# EAGLE design working (EAGLE 9.6.2)
COMPANY: ADAFRUIT INDUSTRIES; DRAWN: KTOWN; REV: A
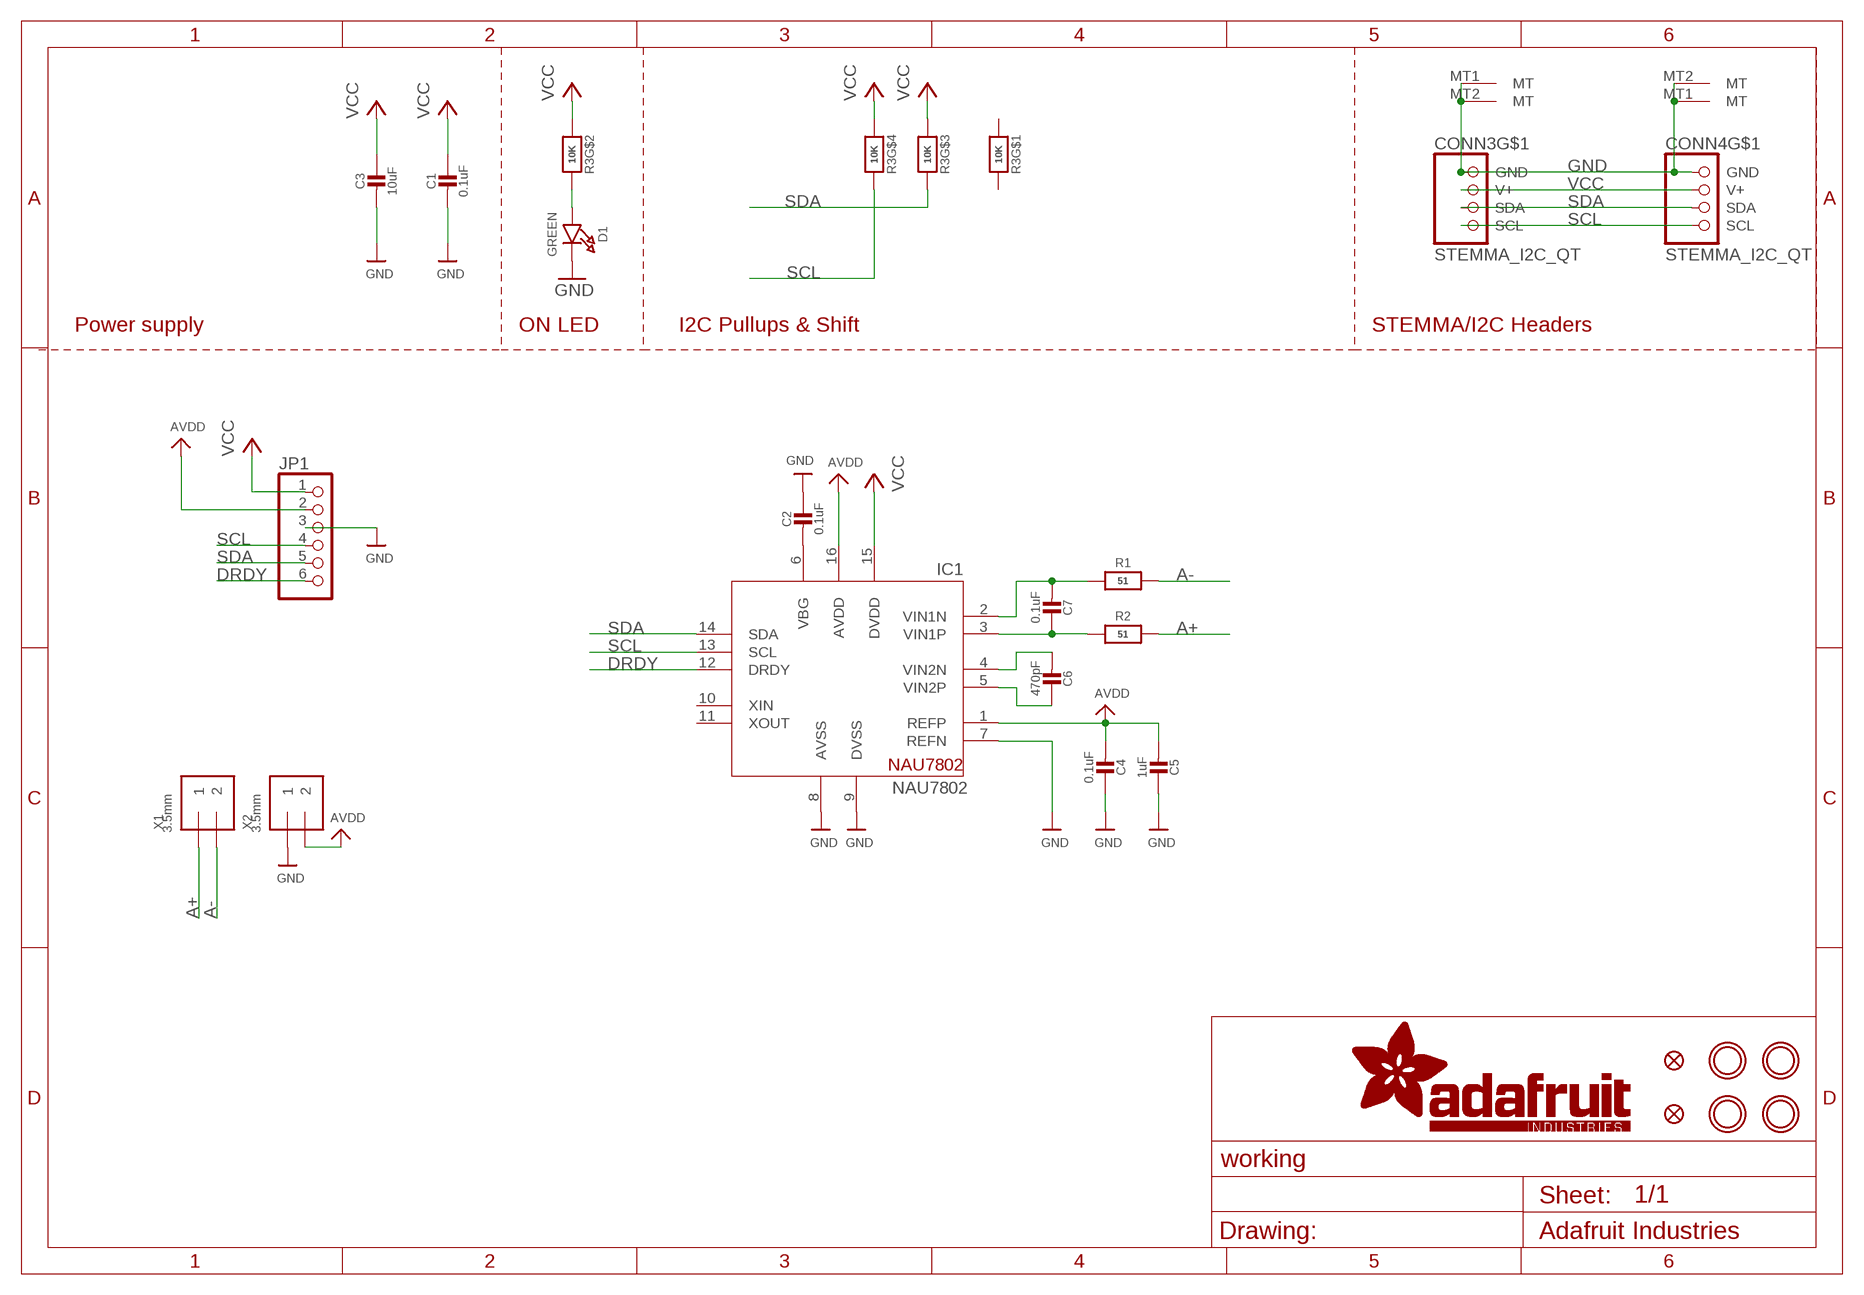
[diagram p0: schematic, sheet 1]

## Parts
C1  0.1uF  CAP_CERAMIC0603_NO  [0603-NO]
C2  0.1uF  CAP_CERAMIC0603_NO  [0603-NO]
C3  10uF  CAP_CERAMIC0805-NOOUTLINE  [0805-NO]
C4  0.1uF  CAP_CERAMIC0603_NO  [0603-NO]
C5  1uF  CAP_CERAMIC0603_NO  [0603-NO]
C6  470pF  CAP_CERAMIC0603_NO  [0603-NO]
C7  0.1uF  CAP_CERAMIC0603_NO  [0603-NO]
CONN3  STEMMA_I2C_QT  [JST_SH4]
CONN4  STEMMA_I2C_QT  [JST_SH4]
D1  GREEN  LED0603_NOOUTLINE  [CHIPLED_0603_NOOUTLINE]
FID3  FIDUCIAL_1MM  [FIDUCIAL_1MM]
FID4  FIDUCIAL_1MM  [FIDUCIAL_1MM]
IC1  NAU7802  [SOIC16_NARROW]
JP1  HEADER-1X670MIL  [1X06_ROUND_70]
R1  51  RESISTOR_0603_NOOUT  [0603-NO]
R2  51  RESISTOR_0603_NOOUT  [0603-NO]
R3  10K  RESISTOR_4PACK  [RESPACK_4X0603]
U$1  MOUNTINGHOLE2.5  [MOUNTINGHOLE_2.5_PLATED]
U$17  MOUNTINGHOLE2.5  [MOUNTINGHOLE_2.5_PLATED]
U$19  MOUNTINGHOLE2.5  [MOUNTINGHOLE_2.5_PLATED]
U$21  MOUNTINGHOLE2.5  [MOUNTINGHOLE_2.5_PLATED]
X1  3.5mm  TERMBLOCK_1X2_3.5MM  [TERMBLOCK_1X2-3.5MM]
X2  3.5mm  TERMBLOCK_1X2_3.5MM  [TERMBLOCK_1X2-3.5MM]

## Nets
A+: R2.2 X1.1
A-: R1.2 X1.2
AVDD: C4.2 C5.2 IC1.1(REFP) IC1.16(AVDD) JP1.2 X2.2
DRDY: IC1.12(DRDY) JP1.6
GND [highpower]: C1.2 C2.1 C3.2 C4.1 C5.1 CONN3.1(GND) CONN3.MT1(MT) CONN3.MT2(MT) CONN4.1(GND) CONN4.MT1(MT) CONN4.MT2(MT) D1.C IC1.7(REFN) IC1.8(AVSS) IC1.9(DVSS) JP1.3 X2.1
N$1: D1.A R3.7
N$2: C2.2 IC1.6(VBG)
N$3: C6.2 IC1.4(VIN2N)
N$4: C6.1 IC1.5(VIN2P)
N$5: C7.1 IC1.3(VIN1P) R2.1
N$6: C7.2 IC1.2(VIN1N) R1.1
SCL: CONN3.4(SCL) CONN4.4(SCL) IC1.13(SCL) JP1.4 R3.5
SDA: CONN3.3(SDA) CONN4.3(SDA) IC1.14(SDA) JP1.5 R3.6
VCC [highpower]: C1.1 C3.1 CONN3.2(V+) CONN4.2(V+) IC1.15(DVDD) JP1.1 R3.2 R3.3 R3.4
Unconnected: IC1.10(XIN) IC1.11(XOUT) R3.1 R3.8

## Notes on the sheet
- Power supply | ON LED | I2C Pullups & Shift | STEMMA/I2C Headers

## Library data of the parts
C1-C7 = microbuilder:CAP_CERAMIC: Ceramic Capacitors For new designs, use the packages preceded by an '_' character since they are more reliable: The following footprints should be used on most boards: _0402 - Standard footprint for regular board layouts _0603 - Standard footprint for regular board layouts _0805 - Standard footprint for regular board layouts _1206 - Standard footprint for regular board layouts For extremely tight-pitch boards where space is at a premium, the following 'micro-pitch' footprints can be used (smaller pads, no silkscreen outline, etc.): _0402MP - Micro-pitch footprint for very dense/compact boards _0603MP - Micro-pitch footprint for very dense/compact boards _0805MP - Micro-pitch footprint for very dense/compact boards _1206MP - Micro-pitch footprint for very dense/compact boards
CONN3 CONN4 = microbuilder:STEMMA_I2C
D1 = microbuilder:LED: LED 0603 - 0603 Surface Mount Package 2mA: Green LED - Low Power (3.9mcd, 2ma, 1.7Vf) - Digikey: 475-2709-2-ND Orange LED - Low Power (9.8mcd, 2ma, 1.8Vf) - Digikey: 475-1194-2-ND Red LED - Low Power (5mcd, 2ma, 1.8Vf) - Digikey: 475-1195-2-ND Yellow LED - Low Power (7mcd, 2ma, 1.8Vf) - Digikey: 475-1196-2-ND 5mA: Blue LED - Low Power (17mcd, 5ma, 2.9Vf) - Digikey: LNJ937W8CRACT-ND 0805 - 0805 Surface Mount Package 2mA: Red LED (8.8mcd, 2mA, 1.8Vf, Clear) - Low Power [Digikey: 475-2510-1-ND] Green LED (5mcd, 2mA, 1.8Vf, Clear) - Low Power [Digikey: 475-2730-1-ND] Yellow LED (11.3mcd, 2mA, 1.8Vf, Clear) - Low Power [Digikey: 475-2555-1-ND] 20mA: Red LED (104mcd, 20mA, Diffused) - LS R976 [Digikey: 475-1278-6-ND] Red LED (12mcd, 20mA, 2.0Vf, Clear) - APT2012EC [Digikey: 754-1128-1-ND] Green LED (15mcd, 20mA, 2.2Vf, Clear) - APT2012GC [Digikey: 754-1131-1-ND] Orange LED (160mcd, 20mA, 2.1Vf, Clear) - APT2012SECK [Digikey: 754-1130-1-ND] 1206 - 1206 Surface Mount Package Green LED (26mcd, 20mA, Diffused) - LG N971 [Digikey: 475-1407-6-ND] Red LED (15mcd, 20mA, Diffused) - LH N974 [Digikey: 475-1416-6-ND] Cree - Cree High-Power Surface Mount LEDs XPEBWT-L1-0000-00D50 - White 111lm 350mA 2.9Vf 6200K 110° XTEAWT-00-0000-00000LEE3 - White 114lm 350mA 2.85Vf 5000K 115° Everlight - Everlight 45-21 Series Surface Mount LEDs 45-21/QK2C-B2832AC2CB2/2T - Warm White 2000mcd 20mA 3.25Vf 3050K 120° 45-21/LK2C-B38452C4CB2/2T - Nuetral White 2000mcd 20mA 3.25Vf 4150K 120° 45-21/LK2C-B50634C6CB2/2T - Cold White 2200mcd 20mA 3.25Vf 5650K 120° PLCC2 Reverse Mount LS T77K-J1L2-1-0-2-R18-Z - Red 11.25mcd 2mA 1.8Vf 630nm 120° LO T77K-L1M2-24-Z - Orange 19.6mcd 2mA 1.8Vf 606nm 120° LY T77K-K2M1-26-Z - Yellow 15.7mcd 2mA 1.8Vf 587nm 120°
FID3 FID4 = microbuilder:FIDUCIAL: Fiducial Alignment Points Various fiducial points for machine vision alignment.; BOM: EXCLUDE
IC1 = adafruit_sensor:NAU7802
JP1 = microbuilder:HEADER-1X6: PIN HEADER
R1 R2 = microbuilder:RESISTOR: Resistors For new designs, use the packages preceded by an '_' character since they are more reliable: The following footprints should be used on most boards: _0402 - Standard footprint for regular board layouts _0603 - Standard footprint for regular board layouts _0805 - Standard footprint for regular board layouts _1206 - Standard footprint for regular board layouts For extremely tight-pitch boards where space is at a premium, the following 'micro-pitch' footprints can be used (smaller pads, no silkscreen outline, etc.): _0402MP - Micro-pitch footprint for very dense/compact boards _0603MP - Micro-pitch footprint for very dense/compact boards _0805MP - Micro-pitch footprint for very dense/compact boards _1206MP - Micro-pitch footprint for very dense/compact boards
R3 = microbuilder:RESISTOR_4PACK: Resistor Packs (4 resistors) 4 x 0603 10K 1/16W - Digikey: YC164J-10KCT-ND
U$1 U$17 U$19 U$21 = microbuilder:MOUNTINGHOLE: Mounting Hole For #2 screws (0.086"/2.18mm width, 0.094"/2.4mm hole) use 2.5mm; BOM: EXCLUDE
X1 X2 = microbuilder:TERMBLOCK_1X2: 3.5mm Terminal block http://www.ladyada.net/library/pcb/eaglelibrary.html

## Net classes
1 highpower: width 0.305 mm, drill 0.483 mm
2 lowpower: width 0.254 mm, drill 0.483 mm

## Board
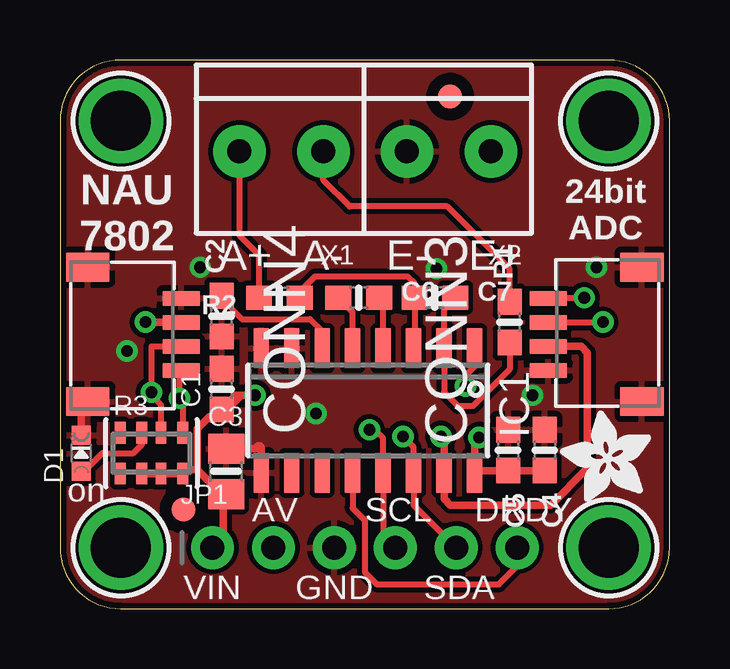
[diagram p1: board, top side]
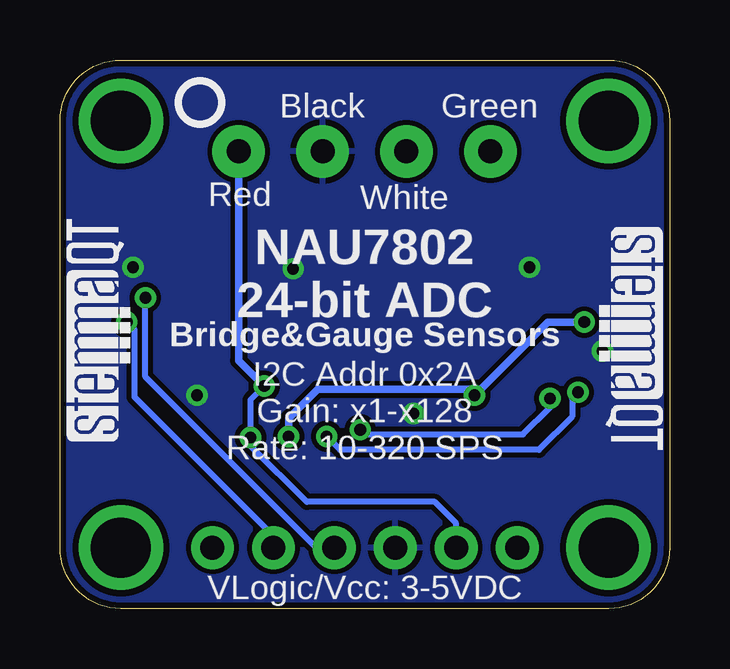
[diagram p2: board, bottom side, seen from below]

Size 25.4 x 22.86 mm. Coordinates in mm from the lower left corner, seen from the top.
Outline: 0,20.32 0,2.54 arc90 2.54,0 22.86,0 arc90 25.4,2.54 25.4,20.32 arc90 22.86,22.86 2.54,22.86 arc90 0,20.32
Copper layers (1*16): Top 0.035mm / dielectric 1.5mm / Bottom 0.035mm
Design rules "adafruit *": minimum track width 8mil, minimum drill 15.5mil, track to track 8mil, track to pad 8mil, pad to pad 8mil, via to via 8mil, smd to smd 8mil, copper to edge 10mil, drill to drill 8mil, minimum pad ring 10mil, minimum via ring 8mil, stop-mask expansion 2mil, vias tented up to drill 20mil, thermal gap 10mil

### Footprints (pad centres in the part's own frame; a part is rotated, then mirrored left to right if it is on the bottom)
0603-NO = smd 1.075 x 1: 1 -0.85,0; 2 0.85,0
0805-NO = smd 1.24 x 1.5: 1 -0.95,0; 2 0.95,0
JST_SH4 = smd 0.6 x 1.55: 1 -1.5,2.514; 2 -0.5,2.514; 3 0.5,2.514; 4 1.5,2.514 | smd 1.2 x 1.8: MT1 -2.8,-1.386; MT2 2.8,-1.386
CHIPLED_0603_NOOUTLINE = smd 0.8 x 0.8: A 0,-0.75; C 0,0.75
FIDUCIAL_1MM = smd 1 x 1: 1 0,0
SOIC16_NARROW = smd 0.635 x 1.651: 1 -4.445,-2.854; 2 -3.175,-2.854; 3 -1.905,-2.854; 4 -0.635,-2.854; 5 0.635,-2.854; 6 1.905,-2.854; 7 3.175,-2.854; 8 4.445,-2.854; 9 4.445,2.346; 10 3.175,2.346; 11 1.905,2.346; 12 0.635,2.346; 13 -0.635,2.346; 14 -1.905,2.346; 15 -3.175,2.346; 16 -4.445,2.346
1X06_ROUND_70 = drill 1 pad 1.778: 1 -6.35,0; 2 -3.81,0; 3 -1.27,0; 4 1.27,0; 5 3.81,0; 6 6.35,0
RESPACK_4X0603 = smd 0.45 x 0.9: 1 -1.3,-0.85; 2 -0.4,-0.85; 3 0.4,-0.85; 4 1.3,-0.85; 5 1.3,0.85; 6 0.4,0.85; 7 -0.4,0.85; 8 -1.3,0.85
MOUNTINGHOLE_2.5_PLATED = drill 2.5 pad 3.2: P$1 0,0
TERMBLOCK_1X2-3.5MM = drill 1 pad 2.184: 1 1.8,0; 2 -1.7,0

### Placement (x,y rotation side)
C1  6.73,9.14 90 top
C2  6.73,12.19 90 top
C3  6.92,5.71 90 top
C4  20.19,6.6 270 top
C5  18.67,6.6 270 top
C6  12.45,12.95 0 top
C7  15.62,12.95 0 top
CONN3  22.86,11.43 90 top
CONN4  2.54,11.43 270 top
D1  0.89,6.48 0 top
FID3  5.14,4.13 0 top
FID4  16.26,21.34 0 top
IC1  12.83,8 180 top
JP1  12.7,2.54 0 top
R1  18.73,11.94 90 top
R2  9.14,12.95 180 top
R3  3.81,6.48 0 top
U$1  2.54,20.32 0 top
U$17  22.86,20.32 0 top
U$19  2.54,2.54 0 top
U$21  22.86,2.54 0 top
U$22  [ADAFRUIT_3.5MM]  24.64,4.45 90 top
U$25  [PCBFEAT-REV-040]  19.56,21.08 0 bottom
U$30  [STEMMAQT]  22.48,6.99 90 bottom
U$31  [STEMMAQT]  2.92,15.88 270 bottom
X1  9.27,19.05 180 top
X2  16.26,19.05 180 top

### Tracks (layer width: path | path; a pad name or v marks a point on that pad's centre or on a via)
A+
  Top 0.254: R2.2 8.29,14.73 7.47,15.56 X1.1
A-
  Top 0.254: R1.2 18.73,14.16 16.13,16.76 12.06,16.76 10.97,17.86 X1.2
AVDD  (via drill 0.48)
  Top 0.254: IC1.1 17.27,10.09 16.89,9.71 v16.89,9.27 | 17.27,6.95 v17.46,7.14
  Top 0.305: C4.2 C5.2 17.37,5.75 IC1.16 17.27,6.95
  Bottom 0.254: v16.89,9.27 17.46,8.7 v17.46,7.14 17.46,6.79 15.11,4.45 9.78,4.45 8.89,3.56 JP1.2
  Bottom 0.305: X2.2 17.96,10.34 v16.89,9.27
DRDY
  Top 0.254: IC1.12 12.19,4.19 12.7,3.68 12.7,1.52 13.21,1.02 18.29,1.02 19.05,1.78 JP1.6
GND  (via drill 0.48)
  Top 0.305: D1.C 0.89,8.36 CONN4.MT2 | C3.2 8.13,6.67 8.25,6.79 8.32,6.79 8.38,6.73 IC1.9
  other vias: 10.67,8.13 5.84,14.22 19.68,8.89 15.68,14.16 2.79,10.73 22.35,14.22
  pour Top: 0,22.86 25.4,22.86 25.4,0 0,0
  pour Bottom: 0,22.86 25.4,22.86 25.4,0 0,0
N$1
  Top 0.254: D1.A 1.02,5.73 1.77,6.48 3.05,6.48 3.41,6.84 R3.7
N$2
  Top 0.254: C2.2 6.73,12.91 7.58,12.07 10.41,12.07 10.92,11.56 IC1.6
N$3
  Top 0.254: IC1.4 13.46,12.79 C6.2
N$4
  Top 0.254: IC1.5 12.19,12.36 C6.1
N$5
  Top 0.254: R2.1 9.99,13.21 10.63,13.84 14.48,13.84 14.77,13.55 C7.1 14.77,10.89 IC1.3
N$6
  Top 0.254: C7.2 16,12.48 IC1.2 16,9.02 16.57,8.45 17.21,8.45 18.73,9.97 R1.1
SCL  (via drill 0.48)
  Top 0.254: R3.5 5.11,8.64 v4.98,8.76 4.98,9.86 CONN4.4 | JP1.4 13.46,3.05 IC1.13 13.46,7.12 13.12,7.45 v12.89,7.45 | v21.84,12.95 21.82,12.93 CONN3.4
  Bottom 0.254: v4.98,8.76 4.98,8.4 6.12,7.26 12.7,7.26 v12.89,7.45 | JP1.4 14.73,2.54 21.84,9.65 v21.84,12.95
SDA  (via drill 0.48)
  Top 0.254: R3.6 4.21,8.49 3.81,8.89 v3.81,9.02 3.81,10.92 3.82,10.93 CONN4.3 | JP1.5 14.73,4.32 IC1.14 14.73,6.73 v14.29,7.18 | CONN3.3 22.61,11.93 v22.62,11.94
  Bottom 0.254: v3.81,9.02 4.06,8.76 4.06,8 5.45,6.62 13.73,6.62 v14.29,7.18 | v22.62,11.94 22.3,11.62 22.3,8.83 16.51,3.04 JP1.5
VCC  (via drill 0.48)
  Top 0.305: R3.2 R3.3 R3.4 5.26,5.78 5.72,5.78 | JP1.1 6.79,2.98 6.79,4.64 C3.1 6.82,4.67 5.72,5.78 | v15.88,7.18 16,7.05 IC1.15 16,4.57 16.26,4.32 20.45,4.32 21.97,5.84 21.97,10.67 21.71,10.93 CONN3.2 | C1.1 7.33,8.89 v8.13,8.89 7.56,8.89 6.67,8 6.22,8 5.72,7.49 5.72,5.78 | CONN4.2 3.56,11.93 v3.56,11.94
  Bottom 0.305: v15.88,7.18 15.88,7.94 14.67,9.14 8.38,9.14 v8.13,8.89 5.08,11.94 v3.56,11.94

### Text on the board
tPlace: 24bit / ADC | NAU / 7802 | A+ | A- | E- | E+ | on | AV | SCL | DRDY | VIN | GND | SDA
bPlace: Green | Black | White | Red | NAU7802 / 24-bit ADC | Bridge&Gauge Sensors | I2C Addr 0x2A / Gain: x1-x128 / Rate: 10-320 SPS | VLogic/Vcc: 3-5VDC